# Altium project lpedt_project_board_cubit.PrjPcb (part 2 of 4)

## Sheet efr32_radio_interface.SchDoc
size Letter; SheetNumber: 4; SheetTotal: 8
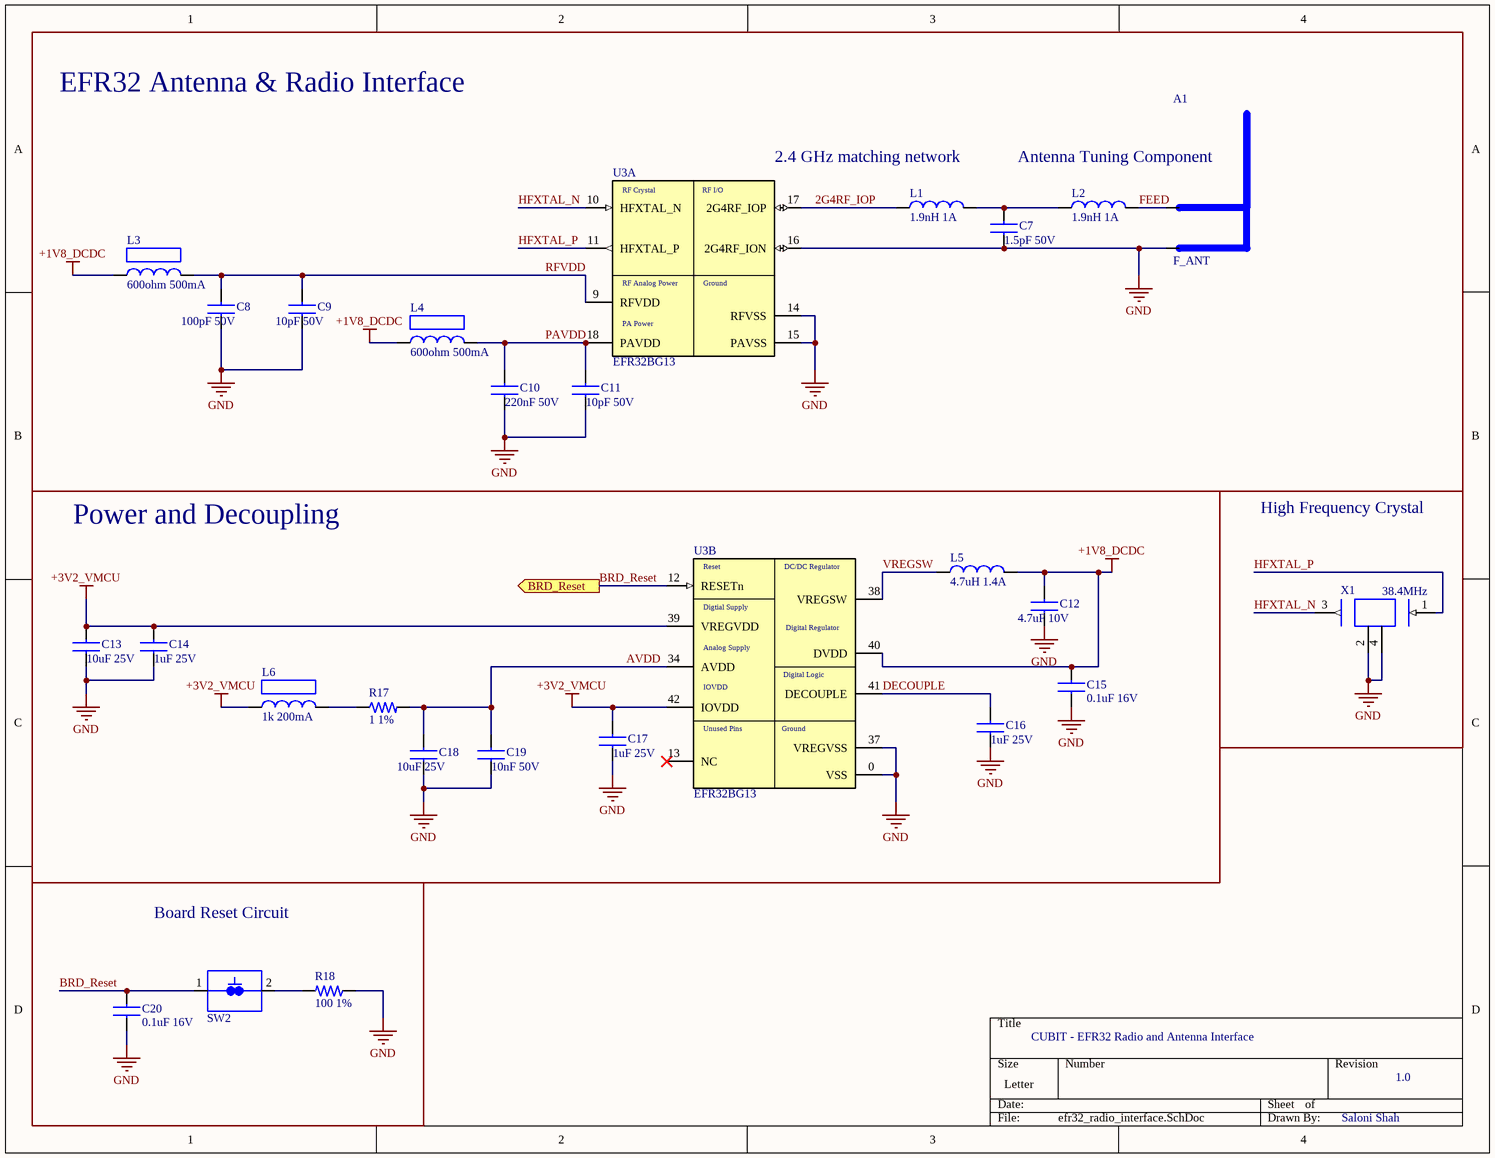
[diagram p2: efr32_radio_interface.SchDoc]

### Parts
A1  F_ANT  [F_ANTENNA_FOOTPRINT]  (net tie, no BOM)
C7  1.5pF 50V  [CAP_0402_1mm]
C8  100pF 50V  [CAP_0805_02X125]
C9  10pF 50V  [CAP_0805_02X125]
C10  220nF 50V  [CAP_0805_02X125]
C11  10pF 50V  [CAP_0805_02X125]
C12  4.7uF 10V  [CAP_0603_1MM]
C13  10uF 25V  [CAP_0805_02X125]
C14  1uF 25V  [CAP_0805_02X125]
C15  0.1uF 16V  [CAP_0603_1MM]
C16  1uF 25V  [CAP_0805_02X125]
C17  1uF 25V  [CAP_0805_02X125]
C18  10uF 25V  [CAP_0805_02X125]
C19  10nF 50V  [CAP_0805_02X125]
C20  0.1uF 16V  [CAP_0603_1MM]
L1  1.9nH 1A  [CAP_0402_1mm]
L2  1.9nH 1A  [CAP_0402_1mm]
L3  600ohm 500mA  [IND_FERRITE_0603_1.6x0.4]
L4  600ohm 500mA  [IND_FERRITE_0603_1.6x0.4]
L5  4.7uH 1.4A  [INDP2523X23N_4u7]
L6  1k 200mA  [CAP_0603_1MM]
R17  1 1%  [CAP_0603_1MM]
R18  100 1%  [2_Chip_0603_RMCF]
SW2  Switch  [Reset Sw]  (value not drawn)
U3  EFR32BG13  [48-QFN_7x7]  (parts A,B of 3)
X1  38.4MHz  [OSC_38.4MHz]

### Blocks framed on the sheet
EFR32 Antenna & Radio Interface: A1 C7-C11 L1-L4 U3
Power and Decoupling: C12-C19 L5 L6 R17 U3
High Frequency Crystal: X1
Board Reset Circuit: C20 R18 SW2

### Ports
BRD_Reset (out)

### Nets
+1V8_DCDC: C12.1 C15.1 L3.1 L4.1 L5.2 U3.40(DVDD)
+3V2_VMCU: C13.1 C14.1 C17.1 L6.1 U3.39(VREGVDD) U3.42(IOVDD)
GND: A1.GND C7.2 C8.2 C9.2 C10.2 C11.2 C12.2 C13.2 C14.2 C15.2 C16.2 C17.2 C18.2 C19.2 C20.2 R18.1 U3.0(VSS) U3.14(RFVSS) U3.15(PAVSS) U3.16(2G4RF_ION) U3.37(VREGVSS) X1.2 X1.4
2G4RF_IOP: L1.1 U3.17(2G4RF_IOP)
AVDD: C18.1 C19.1 R17.2 U3.34(AVDD)
BRD_Reset: C20.1 SW2.1 U3.12(RESETn) ; port BRD_Reset
DECOUPLE: C16.1 U3.41(DECOUPLE)
FEED: A1.FEED L2.2
HFXTAL_N: U3.10(HFXTAL_N) X1.3
HFXTAL_P: U3.11(HFXTAL_P) X1.1
PAVDD: C10.1 C11.1 L4.2 U3.18(PAVDD)
RFVDD: C8.1 C9.1 L3.2 U3.9(RFVDD)
VREGSW: L5.1 U3.38(VREGSW)
NetC7_1: C7.1 L1.2 L2.1
NetL6_2: L6.2 R17.1
NetR18_2: R18.2 SW2.2

Not connected (* = marked no-connect by the designer): U3 13(NC)*

### Notes on the sheet
- 2.4 GHz matching network
- Antenna Tuning Component
- CUBIT - EFR32 Radio and Antenna Interface
- 1.0
- Saloni Shah
- (in symbol EFR32BG13P732F512GM48-D, part A) RF Crystal; RF I/O; RF Analog Power; Ground; PA Power
- (in symbol EFR32BG13P732F512GM48-D, part B) Reset; DC/DC Regulator; Digtial Supply; Digital Regulator; Analog Supply; Digital Logic; Unused Pins; Ground

### Library data of the parts
C7 = GCM1555C1H1R5JA16D: Cap Ceramic 1.5pF 50V C0G 5% Pad SMD 0402 125C Automotive T/R; Manufacturer: Murata; Supplier 1: Digi-Key; Manufacturer Part Number: GCM1555C1H1R5JA16D; RoHS: Yes; Category: Ceramic Capacitors; Stock 1: 77943; Pricing 1: 1=0.10000, 10=0.04700, 50=0.02580, 100=0.02100, 500=0.01502, 1000=0.01180, 2500=0.01072, 5000=0.00987 (USD); Mount: Surface Mount; Case/Package: 0402; Case Code (Imperial): 0402; Case Code (Metric): 1005; Min Operating Temperature: -55°C; Max Operating Temperature: 125°C; Packaging: Cut Tape; Capacitance: 1.5pF; Tolerance: 5%; Voltage Rating: 50V; Ratings: AEC-Q200; ComponentLink1URL: http://search.murata.co.jp/Ceramy/image/img/A01X/G101/ENG/GCM1555C1H1R5JA16-01.pdf?src-supplier=Digi-Key; ComponentLink1Description: http://search.murata.co.jp/Ceramy/image/img/A01X/G101/ENG/GCM1555C1H1R5JA16-01.pdf?src-supplier=Digi-Key
C8 = CC0805KRX7R9BB101: Cap 0.1nF ±10% 50V X7R 0805; Manufacturer: Yageo; Supplier 1: Digi-Key; Manufacturer Part Number: CC0805KRX7R9BB101; RoHS: Yes; Category: Ceramic Capacitors; Stock 1: 2346; Pricing 1: 1=0.11000, 10=0.08200, 50=0.04620, 100=0.03830, 500=0.02688, 1000=0.02225 (USD); Mount: Surface Mount; Case/Package: 0805; Case Code (Imperial): 0805; Case Code (Metric): 2012; Weight: 0.000194oz; Min Operating Temperature: -55°C; Max Operating Temperature: 125°C; Capacitance: 100pF; Tolerance: 10%; Packaging: Tape and Reel; Voltage Rating (DC): 50V; Voltage Rating: 50V; Dielectric: X7R; Termination: SMD/SMT; Resistor Type: Ceramic; Series: CC; Construction: Flat; Length: 2mm; Width: 0.049inch; Thickness: 0.028inch; Depth: 1.25mm; Radiation Hardening: No; Lead Free: Lead Free; Halogen Free: Halogen Free; RoHS Compliant: Yes; ComponentLink1URL: https://datasheet.ciiva.com/11465/upy-gphc-x7r-6-3v-to-50v-8-11465306.pdf?src-supplier=Avnet; ComponentLink1Description: https://datasheet.ciiva.com/11465/upy-gphc-x7r-6-3v-to-50v-8-11465306.pdf?src-supplier=Avnet; ComponentLink2URL: https://datasheet.ciiva.com/17436/upy-gphc-x7r-6-3v-to-50v-8-17436651.pdf?src-supplier=Avnet+Europe; ComponentLink2Description: https://datasheet.ciiva.com/17436/upy-gphc-x7r-6-3v-to-50v-8-17436651.pdf?src-supplier=Avnet+Europe
C9 C11 = C0805C100K5RACTU: Cap Ceramic 10pF 50V X7R 10% SMD 0805 125°C Paper T/R; Manufacturer: KEMET; Supplier 1: Digi-Key; Manufacturer Part Number: C0805C100K5RACTU; RoHS: Yes; Category: Ceramic Capacitors; Stock 1: 16008; Pricing 1: 1=0.29000, 10=0.19600, 50=0.11780, 100=0.09950, 500=0.06806, 1000=0.06021 (USD); Case/Package: 0805; Dielectric Material: Ceramic; Voltage Rating (DC): 50V; Dielectric: X7R; Tolerance: 10%; Capacitance: 10pF; RoHS Compliant: Yes; ComponentLink1URL: http://www.farnell.com/datasheets/2747373.pdf?src-supplier=Farnell; ComponentLink1Description: http://www.farnell.com/datasheets/2747373.pdf?src-supplier=Farnell; ComponentLink2URL: http://www.farnell.com/datasheets/2747373.pdf?src-supplier=Newark; ComponentLink2Description: http://www.farnell.com/datasheets/2747373.pdf?src-supplier=Newark
C10 = CC0805KKX7R9BB224: Cap 220nF ±10% 50V X7R 0805; Manufacturer: Yageo; Supplier 1: Digi-Key; Manufacturer Part Number: CC0805KKX7R9BB224; RoHS: Yes; Category: Ceramic Capacitors; Stock 1: 57217; Pricing 1: 1=0.18000, 10=0.12600, 50=0.07140, 100=0.05920, 500=0.04154, 1000=0.03439 (USD); Mount: Surface Mount; Case/Package: 0805; Case Code (Imperial): 0805; Case Code (Metric): 2012; Weight: 0.000194oz; Min Operating Temperature: -55°C; Max Operating Temperature: 125°C; Capacitance: 220nF; Tolerance: 10%; Packaging: Tape and Reel; Voltage Rating: 50V; Voltage Rating (DC): 50V; Dielectric: X7R; Termination: SMD/SMT; Resistor Type: Ceramic; Series: CC; Construction: Flat; Length: 2mm; Width: 0.049inch; Height: 1.25mm; Thickness: 0.057inch; Depth: 1.25mm; Radiation Hardening: No; Lead Free: Lead Free; Halogen Free: Halogen Free; RoHS Compliant: Yes; ComponentLink1URL: https://datasheet.ciiva.com/26862/getdatasheetpartid-403679-26862968.pdf?src-supplier=Verical; ComponentLink1Description: https://datasheet.ciiva.com/26862/getdatasheetpartid-403679-26862968.pdf?src-supplier=Verical; ComponentLink2URL: https://datasheet.ciiva.com/15375/yageo-486313-494411-15375807.pdf?src-supplier=Mouser; ComponentLink2Description: https://datasheet.ciiva.com/15375/yageo-486313-494411-15375807.pdf?src-supplier=Mouser
C12 = CL10A475KP8NNNC: Cap CL10 Series 4.7 uF 10 V ±10 % Tolerance X5R SMT Multilayer Ceramic Capacitor; Manufacturer: Samsung; Tolerance: 10%; Supplier 1: Digi-Key; Manufacturer Part Number: CL10A475KP8NNNC; RoHS: Yes; Category: Ceramic Capacitors; Stock 1: 5517923; Pricing 1: 1=0.10000, 10=0.04700, 50=0.02580, 100=0.02110, 500=0.01506, 1000=0.01183 (USD); Mount: Surface Mount; Case/Package: 0603; Case Code (Metric): 1608; Case Code (Imperial): 0603; Contact Plating: Tin; Min Operating Temperature: -55°C; Max Operating Temperature: 85°C; Capacitance: 4.7uF; Dielectric: X5R; Package Quantity: 1; Packaging: Tape and Reel; Voltage Rating: 10V; Series: CL; Construction: Flat; Length: 1.6mm; Width: 0.031inch; Height: 0.8mm; Thickness: 0.035inch; Depth: 0.8mm; Radiation Hardening: No; RoHS Compliant: Yes; ComponentLink1URL: https://datasheet.ciiva.com/25797/cl10a475kp8nnnc-25797520.pdf?src-supplier=Digi-Key; ComponentLink1Description: https://datasheet.ciiva.com/25797/cl10a475kp8nnnc-25797520.pdf?src-supplier=Digi-Key; ComponentLink2URL: https://datasheet.ciiva.com/26838/getdatasheetpartid-358676-26838384.pdf?src-supplier=Verical; ComponentLink2Description: https://datasheet.ciiva.com/26838/getdatasheetpartid-358676-26838384.pdf?src-supplier=Verical; ComponentLink3URL: https://datasheet.ciiva.com/16318/cl05b104kq5nnnc-16318245.pdf?src-supplier=Future+Electronics; ComponentLink3Description: https://datasheet.ciiva.com/16318/cl05b104kq5nnnc-16318245.pdf?src-supplier=Future+Electronics
C13 C18 = GRM21BR61E106KA73K: Cap 0805 25 V 10 uF ±20% Tolerance X5R Monolithic Ceramic Chip Capacitor; Manufacturer: Murata; Tolerance: 10%; Supplier 1: Digi-Key; Manufacturer Part Number: GRM21BR61E106KA73K; RoHS: Yes; Category: Ceramic Capacitors; Stock 1: 1875; Pricing 1: 1=0.23000, 10=0.15700, 50=0.09400, 100=0.07940, 500=0.05434, 1000=0.04807, 2500=0.04598, 5000=0.04180 (USD); Mount: Surface Mount; Case/Package: 0805; Weight: 0.000335oz; Min Operating Temperature: -55°C; Max Operating Temperature: 85°C; Packaging: Tape and Reel; Capacitance: 10uF; Voltage Rating: 25V; Package Quantity: 10000; Dielectric: X5R; Voltage Rating (DC): 25V; Length: 0.079inch; Width: 0.049inch; Thickness: 0.055inch; RoHS Compliant: Yes; ComponentLink1URL: http://www.mouser.com/ds/2/281/c02e-2905.pdf?src-supplier=Mouser; ComponentLink1Description: http://www.mouser.com/ds/2/281/c02e-2905.pdf?src-supplier=Mouser; ComponentLink2URL: http://search.murata.co.jp/Ceramy/image/img/A01X/G101/ENG/GRM21BR61E106KA73-01.pdf?src-supplier=Digi-Key; ComponentLink2Description: http://search.murata.co.jp/Ceramy/image/img/A01X/G101/ENG/GRM21BR61E106KA73-01.pdf?src-supplier=Digi-Key; ComponentLink3URL: https://search.murata.co.jp/Ceramy/image/img/A01X/G101/ENG/GRM21BR61E106KA73-01.pdf?src-supplier=Digi-Key; ComponentLink3Description: https://search.murata.co.jp/Ceramy/image/img/A01X/G101/ENG/GRM21BR61E106KA73-01.pdf?src-supplier=Digi-Key
C14 C16 C17 = GRM216R61E105KA12D: Cap 1 µF ±10% 25V Ceramic Capacitor X5R 0805 (2012 Metric); Manufacturer: Murata; Supplier 1: Digi-Key; Manufacturer Part Number: GRM216R61E105KA12D; RoHS: Yes; Category: Ceramic Capacitors; Stock 1: 738438; Pricing 1: 4000=0.09051, 8000=0.08518, 12000=0.08252, 28000=0.07986, 100000=0.06921 (USD); Mount: Surface Mount; Case/Package: 0805; Number of Pins: 2; Case Code (Imperial): 0805; Case Code (Metric): 2012; Material: Ceramic; Min Operating Temperature: -55°C; Max Operating Temperature: 85°C; Package Quantity: 1; Series: GRM; Packaging: Tape and Reel; Capacitance: 1uF; Voltage Rating: 25V; Voltage Rating (DC): 25V; Tolerance: 10%; Dielectric: X5R; Termination: SMD/SMT; Voltage: 25V; Construction: Flat; Length: 2mm; Width: 1.25mm; Height: 0.6mm; Thickness: 0.028inch; Depth: 1.25mm; Radiation Hardening: No; Lead Free: Lead Free; REACH SVHC: No SVHC; RoHS Compliant: Yes; ComponentLink1URL: https://datasheet.ciiva.com/11787/0900766b80ef921d-11787891.pdf?src-supplier=RSComponents; ComponentLink1Description: https://datasheet.ciiva.com/11787/0900766b80ef921d-11787891.pdf?src-supplier=RSComponents; ComponentLink2URL: https://datasheet.ciiva.com/5424/product-5424880.pdf?src-supplier=Mouser; ComponentLink2Description: https://datasheet.ciiva.com/5424/product-5424880.pdf?src-supplier=Mouser; ComponentLink3URL: https://datasheet.ciiva.com/3777/337grm216r61e105ka1223-3777289.pdf?src-supplier=Arrow+Electronics; ComponentLink3Description: https://datasheet.ciiva.com/3777/337grm216r61e105ka1223-3777289.pdf?src-supplier=Arrow+Electronics; ComponentLink4URL: https://datasheet.ciiva.com/7719/c02e-7719049.pdf?src-supplier=Element14; ComponentLink4Description: https://datasheet.ciiva.com/7719/c02e-7719049.pdf?src-supplier=Element14; ComponentLink5URL: https://datasheet.ciiva.com/22706/1889704-22706791.pdf?src-supplier=Element14; ComponentLink5Description: https://datasheet.ciiva.com/22706/1889704-22706791.pdf?src-supplier=Element14; ComponentLink6URL: https://datasheet.ciiva.com/138/partnumbering-e-01-138518.pdf?src-supplier=Digi-Key; ComponentLink6Description: https://datasheet.ciiva.com/138/partnumbering-e-01-138518.pdf?src-supplier=Digi-Key; ComponentLink7URL: https://datasheet.ciiva.com/138/partnumbering-e-01-138517.pdf?src-supplier=Digi-Key; ComponentLink7Description: https://datasheet.ciiva.com/138/partnumbering-e-01-138517.pdf?src-supplier=Digi-Key; ComponentLink8URL: https://datasheet.ciiva.com/138/partnumbering-e-01-138519.pdf?src-supplier=Digi-Key; ComponentLink8Description: https://datasheet.ciiva.com/138/partnumbering-e-01-138519.pdf?src-supplier=Digi-Key; ComponentLink9URL: https://datasheet.ciiva.com/2989/product-2989638.pdf?src-supplier=Avnet; ComponentLink9Description: https://datasheet.ciiva.com/2989/product-2989638.pdf?src-supplier=Avnet
C15 C20 = C0805C104K4RACAUTO: Cap Ceramic 0.1uF 16V X7R 10% SMD 0603 125°C Paper T/R; Manufacturer: KEMET; Capacitance: 100nF; Supplier 1: Digi-Key; Manufacturer Part Number: C0805C104K4RACAUTO; RoHS: Yes; Category: Ceramic Capacitors; Stock 1: 15900; Pricing 1: 1=0.24000, 10=0.16200, 50=0.09700, 100=0.08190, 500=0.05606, 1000=0.04959 (USD); Case/Package: 0805; Min Operating Temperature: -55°C; Max Operating Temperature: 125°C; Tolerance: 10%; Packaging: Tape and Reel; Dielectric: X7R; Length: 2mm; Depth: 1.25mm; RoHS Compliant: Yes; ComponentLink1URL: http://components.arrow.com/part/dataview/0323_00325188?src-supplier=Arrow+Europe; ComponentLink1Description: http://components.arrow.com/part/dataview/0323_00325188?src-supplier=Arrow+Europe
C19 = CL21B103KBCNNNC: Cap 10nF ±10% 50V X7R 0805; Manufacturer: Samsung; Supplier 1: Digi-Key; Manufacturer Part Number: CL21B103KBCNNNC; RoHS: Yes; Category: Ceramic Capacitors; Stock 1: 358475; Pricing 1: 1=0.10000, 10=0.05000, 50=0.02700, 100=0.02210, 500=0.01578, 1000=0.01240 (USD); Mount: Surface Mount; Case/Package: 0805; Case Code (Metric): 2012; Case Code (Imperial): 0805; Contact Plating: Tin; Min Operating Temperature: -55°C; Max Operating Temperature: 125°C; Packaging: Tape and Reel; Series: CL; Voltage Rating: 50V; Capacitance: 10nF; Tolerance: 10%; Dielectric: X7R; Voltage Rating (DC): 50V; Construction: Flat; Length: 2mm; Width: 0.049inch; Height: 0.85mm; Thickness: 0.037inch; Depth: 1.25mm; Radiation Hardening: No; RoHS Compliant: Yes; Lead Free: Lead Free; ComponentLink1URL: https://datasheet.ciiva.com/26920/getdatasheetpartid-640087-26920198.pdf?src-supplier=Verical; ComponentLink1Description: https://datasheet.ciiva.com/26920/getdatasheetpartid-640087-26920198.pdf?src-supplier=Verical; ComponentLink2URL: https://datasheet.ciiva.com/26787/cl21b103kbcnnnc-26787008.pdf?src-supplier=IIIC; ComponentLink2Description: https://datasheet.ciiva.com/26787/cl21b103kbcnnnc-26787008.pdf?src-supplier=IIIC
L1 L2 = LQG15WZ1N9S02D: Inductor Chip 1.9nH 0.3nH Tolerance 2-Pin 0402 Paper T/R; Manufacturer: Murata; Supplier 1: Digi-Key; Manufacturer Part Number: LQG15WZ1N9S02D; RoHS: Yes; Category: Fixed Inductors; Stock 1: 7252; Pricing 1: 1=0.14000, 10=0.12900, 25=0.11440, 50=0.09720, 100=0.08580, 250=0.07864, 500=0.07150, 1000=0.06006, 2500=0.05148 (USD); RoHS Compliant: Yes
L3 L4 = BLM18AG601SN1D: Ferrite Beads 0603 600Ω ±25% DCR=0.38Ω 500mA; Manufacturer: Murata; Material: Steel,Ferrite; Frequency: 100MHz; Impedance: 600R; Number of Lines: 1; DC Resistance (DCR): 380mR; Shielding: Unshielded; Supplier 1: Digi-Key; Manufacturer Part Number: BLM18AG601SN1D; RoHS: Yes; Category: Inductors; Pricing 1: 1=0.10000, 10=0.07900, 25=0.07200, 50=0.06480, 100=0.04760, 250=0.03460, 500=0.03170, 1000=0.02738 (USD); Case/Package: 0603; Number of Pins: 2; Core Material: Ferrite; Case Code (Metric): 1608; Case Code (Imperial): 0603; Weight: 7.1E-05oz; Min Operating Temperature: -55°C; Max Operating Temperature: 125°C; Package Quantity: 1; Packaging: Tape and Reel; Tolerance: 25%; Max Current Rating: 500mA; Current Rating: 500mA; Termination: SMD/SMT; Max DC Current: 500mA; Test Frequency: 100MHz; DC Current: 500mA; Number of Circuits: 1; Length: 1.6mm; Width: 0.8mm; Height: 0.8mm; Depth: 0.8mm; Radiation Hardening: No; RoHS Compliant: Yes; Lead Free: Lead Free; REACH SVHC: No SVHC; Military Standard: Not; ComponentLink1URL: https://datasheet.ciiva.com/19460/1844766-19460213.pdf?src-supplier=Jameco; ComponentLink1Description: https://datasheet.ciiva.com/19460/1844766-19460213.pdf?src-supplier=Jameco; ComponentLink2URL: https://datasheet.ciiva.com/41449/001172228-da-01-en-drossel-0603-600r-1-6x0-8mm-4000st-41449517.pdf?src-supplier=Conrad; ComponentLink2Description: https://datasheet.ciiva.com/41449/001172228-da-01-en-drossel-0603-600r-1-6x0-8mm-4000st-41449517.pdf?src-supplier=Conrad; ComponentLink3URL: https://datasheet.ciiva.com/29347/442309-da-01-en-chip-drossel-0603-600r-500ma-1-6x0-8mm-29347900.pdf?src-supplier=Conrad; ComponentLink3Description: https://datasheet.ciiva.com/29347/442309-da-01-en-chip-drossel-0603-600r-500ma-1-6x0-8mm-29347900.pdf?src-supplier=Conrad; ComponentLink4URL: https://datasheet.ciiva.com/1466/1756147-1466934.pdf?src-supplier=Element14; ComponentLink4Description: https://datasheet.ciiva.com/1466/1756147-1466934.pdf?src-supplier=Element14; ComponentLink5URL: https://datasheet.ciiva.com/1466/1756147-1466933.pdf?src-supplier=Element14; ComponentLink5Description: https://datasheet.ciiva.com/1466/1756147-1466933.pdf?src-supplier=Element14; ComponentLink6URL: https://datasheet.ciiva.com/1012/l0110s0100blm18a-1012018.pdf?src-supplier=Digi-Key; ComponentLink6Description: https://datasheet.ciiva.com/1012/l0110s0100blm18a-1012018.pdf?src-supplier=Digi-Key; ComponentLink7URL: https://datasheet.ciiva.com/1012/l0110s0100blm18a-1012017.pdf?src-supplier=Digi-Key; ComponentLink7Description: https://datasheet.ciiva.com/1012/l0110s0100blm18a-1012017.pdf?src-supplier=Digi-Key; ComponentLink8URL: https://datasheet.ciiva.com/1012/l0110s0100blm18a-1012019.pdf?src-supplier=Digi-Key; ComponentLink8Description: https://datasheet.ciiva.com/1012/l0110s0100blm18a-1012019.pdf?src-supplier=Digi-Key; ComponentLink9URL: https://datasheet.ciiva.com/16210/l0110s0100blm18a-16210006.pdf?src-supplier=Future+Electronics; ComponentLink9Description: https://datasheet.ciiva.com/16210/l0110s0100blm18a-16210006.pdf?src-supplier=Future+Electronics; ComponentLink10URL: https://datasheet.ciiva.com/3081/l0110s0100blm18a-3081613.pdf?src-supplier=Avnet; ComponentLink10Description: https://datasheet.ciiva.com/3081/l0110s0100blm18a-3081613.pdf?src-supplier=Avnet
L5 = DFE252012P-4R7M=P2: 4.7uH, 20%, 1 Element, Metal Alloy-Core, SMD, 1008; Manufacturer: Murata; DC Resistance (DCR): 200mR; Inductor Type: GENERAL PURPOSE INDUCTOR; Number of Functions: 1; Shape/Size Description: RECTANGULAR PACKAGE; Shielding: Shielded; Test Frequency: 1MHz; Supplier 1: Digikey; Manufacturer Part Number: DFE252012P-4R7M=P2; RoHS: Yes; Category: Fixed Inductors; Stock 1: 44321; Pricing 1: 1=0.28, 10=0.228, 25=0.21, 50=0.1926, 100=0.1698, 250=0.1646, 500=0.14708, 1000=0.11907 (USD); Number of Pins: 2; Core Material: Metal; Min Operating Temperature: -40°C; Max Operating Temperature: 125°C; Tolerance: 20%; Inductance-Nom (L): 4.7uH; Rated Current-Max: 1.4A; Surface Mount: Yes; Terminal Placement: Dual Ended; Termination: Wraparound; Reach SVHC Compliant: Yes; RoHS Compliant: Yes; ComponentLink1URL: https://psearch.en.murata.com:443/inductor/product/DFE252012P-4R7M_.pdf?src-supplier=IHS+Markit; ComponentLink1Description: https://psearch.en.murata.com:443/inductor/product/DFE252012P-4R7M_.pdf?src-supplier=IHS+Markit; ComponentLink2URL: http://www.farnell.com/datasheets/2550138.pdf?src-supplier=Farnell; ComponentLink2Description: http://www.farnell.com/datasheets/2550138.pdf?src-supplier=Farnell; ComponentLink3URL: http://www.murata.com/~/media/webrenewal/products/inductor/chip/tokoproducts/wirewoundmetalalloychiptype/m_dfe252012p.ashx?src-supplier=Digikey; ComponentLink3Description: http://www.murata.com/~/media/webrenewal/products/inductor/chip/tokoproducts/wirewoundmetalalloychiptype/m_dfe252012p.ashx?src-supplier=Digikey; ComponentLink4URL: https://www.murata.com/~/media/webrenewal/products/inductor/chip/tokoproducts/wirewoundmetalalloychiptype/m_dfe252012p.ashx?src-supplier=Digikey; ComponentLink4Description: https://www.murata.com/~/media/webrenewal/products/inductor/chip/tokoproducts/wirewoundmetalalloychiptype/m_dfe252012p.ashx?src-supplier=Digikey; ComponentLink5URL: http://www.toko.co.jp/products/pdf/inductors/dfe252012p.pdf?src-supplier=Avnet; ComponentLink5Description: http://www.toko.co.jp/products/pdf/inductors/dfe252012p.pdf?src-supplier=Avnet; ComponentLink6URL: http://www.farnell.com/datasheets/2550138.pdf?src-supplier=Newark; ComponentLink6Description: http://www.farnell.com/datasheets/2550138.pdf?src-supplier=Newark
L6 = 74279266: Ferrite Beads WE-CBF 0603 SMD Bead 100MHz 1000Ohm 200mA; Manufacturer: Wurth Electronics; Tolerance: 25%; Impedance: 1kR; DC Resistance (DCR): 600mR; Inductance: 1.8nH; Shielding: Unshielded; Number of Lines: 1; Supplier 1: Digi-Key; Manufacturer Part Number: 74279266; RoHS: Yes; Category: Ferrite Beads and Chips; Pricing 1: 1=0.18000, 50=0.17400, 100=0.16000, 500=0.15300, 1000=0.14600, 2000=0.13900 (USD); Case/Package: SMD/SMT; Case Code (Metric): 1608; Case Code (Imperial): 0603; Core Material: Ferrite; Min Operating Temperature: -55°C; Max Operating Temperature: 125°C; Packaging: Tape and Reel; Series: WE-CBF; Current Rating: 200mA; Max DC Current: 200mA; Termination: SMD/SMT; Test Frequency: 100MHz; Max Current Rating: 200mA; Length: 1.6mm; Width: 0.8mm; Height: 0.8mm; Depth: 0.8mm; REACH SVHC: Unknown; Lead Free: Lead Free; RoHS Compliant: Yes; ComponentLink1URL: https://datasheet.ciiva.com/23763/74279266-23763009.pdf?src-supplier=Newark; ComponentLink1Description: https://datasheet.ciiva.com/23763/74279266-23763009.pdf?src-supplier=Newark; ComponentLink2URL: https://datasheet.ciiva.com/11799/0900766b801ef1d0-11799352.pdf?src-supplier=RSComponents; ComponentLink2Description: https://datasheet.ciiva.com/11799/0900766b801ef1d0-11799352.pdf?src-supplier=RSComponents; ComponentLink3URL: https://datasheet.ciiva.com/12395/74279266-221135-12395453.pdf?src-supplier=Mouser; ComponentLink3Description: https://datasheet.ciiva.com/12395/74279266-221135-12395453.pdf?src-supplier=Mouser; ComponentLink4URL: https://datasheet.ciiva.com/14971/74279266-14971192.pdf?src-supplier=Digi-Key; ComponentLink4Description: https://datasheet.ciiva.com/14971/74279266-14971192.pdf?src-supplier=Digi-Key; ComponentLink5URL: https://datasheet.ciiva.com/14634/0900766b801ef1d0-14634816.pdf?src-supplier=Allied+Electronics; ComponentLink5Description: https://datasheet.ciiva.com/14634/0900766b801ef1d0-14634816.pdf?src-supplier=Allied+Electronics; ComponentLink6URL: https://datasheet.ciiva.com/1466/1705901-1466509.pdf?src-supplier=Element14; ComponentLink6Description: https://datasheet.ciiva.com/1466/1705901-1466509.pdf?src-supplier=Element14; ComponentLink7URL: https://datasheet.ciiva.com/22711/1705901-22711422.pdf?src-supplier=Element14; ComponentLink7Description: https://datasheet.ciiva.com/22711/1705901-22711422.pdf?src-supplier=Element14; ComponentLink8URL: https://datasheet.ciiva.com/48698/001087059-da-01-ml-we-cbf-smd-ferrit-74279266-de-en-48698427.pdf?src-supplier=Conrad; ComponentLink8Description: https://datasheet.ciiva.com/48698/001087059-da-01-ml-we-cbf-smd-ferrit-74279266-de-en-48698427.pdf?src-supplier=Conrad
R17 = RC0603FR-101RL: Res 1 Ohm 1% 1/10W ±200ppm/°C Molded SMD SMD Paper T/R; Manufacturer: Yageo; Resistance: 1R; Power Rating: 100mW; Voltage Rating: 50V; Supplier 1: Digi-Key; Manufacturer Part Number: RC0603FR-101RL; Category: Chip SMD Resistors; Stock 1: 19075; Pricing 1: 1=0.10000, 10=0.04800, 100=0.01940, 1000=0.00872, 2500=0.00756, 5000=0.00625 (USD); Case/Package: 0603; Case Code (Imperial): 0603; Case Code (Metric): 1608; Contact Plating: Tin; Min Operating Temperature: -55°C; Max Operating Temperature: 155°C; Tolerance: 1%; Packaging: Tape and Reel; Resistor Type: Thick Film; Termination: SMD/SMT; Temperature Coefficient: 200ppm/°C; Series: RC; Construction: Rectangular; Length: 1.6mm; Width: 0.8mm; Height: 0.45mm; Depth: 0.8mm; Radiation Hardening: No; Military Standard: Not; RoHS Compliant: Yes; ComponentLink1URL: http://www.mouser.com/ds/2/447/RC0603-272842.pdf?src-supplier=Mouser; ComponentLink1Description: http://www.mouser.com/ds/2/447/RC0603-272842.pdf?src-supplier=Mouser; ComponentLink2URL: http://components.arrow.com/part/dataview/0323_03914755?src-supplier=Arrow+Europe; ComponentLink2Description: http://components.arrow.com/part/dataview/0323_03914755?src-supplier=Arrow+Europe; ComponentLink3URL: http://www.yageo.com/documents/recent/PYu-RC_Group_51_RoHS_L_2.pdf?src-supplier=Avnet; ComponentLink3Description: http://www.yageo.com/documents/recent/PYu-RC_Group_51_RoHS_L_2.pdf?src-supplier=Avnet; ComponentLink4URL: http://www.yageo.com/documents/recent/PYu-RC0603_51_RoHS_L_5.pdf?src-supplier=Avnet+Europe; ComponentLink4Description: http://www.yageo.com/documents/recent/PYu-RC0603_51_RoHS_L_5.pdf?src-supplier=Avnet+Europe; ComponentLink5URL: https://datasheet.octopart.com/RC0603FR-101RL-Yageo-datasheet-8328172.pdf?src-supplier=_legacy+Avnet; ComponentLink5Description: https://datasheet.octopart.com/RC0603FR-101RL-Yageo-datasheet-8328172.pdf?src-supplier=_legacy+Avnet; ComponentLink6URL: https://datasheet.octopart.com/RC0603FR-101RL-Yageo-datasheet-73766026.pdf; ComponentLink6Description: https://datasheet.octopart.com/RC0603FR-101RL-Yageo-datasheet-73766026.pdf
R18 = RMCF0603FT100R: Res 100 Ohm 1% 1/10W ±100ppm/°C Molded SMD SMD Paper T/R; Manufacturer: Stackpole Electronics; Resistance: 100R; Power Rating: 100mW; Supplier 1: Digi-Key; Manufacturer Part Number: RMCF0603FT100R; RoHS: Yes; Category: Chip SMD Resistors; Pricing 1: 1=0.10000, 10=0.01700, 100=0.00680, 1000=0.00305, 2500=0.00264 (USD); Mount: Surface Mount; Case/Package: 0603; Case Code (Metric): 1608; Case Code (Imperial): 0603; Contact Plating: Tin,Matte; Size Code: 0603; Min Operating Temperature: -55°C; Max Operating Temperature: 155°C; Tolerance: 1%; Packaging: Tape and Reel; Resistor Type: Thick Film; Number of Terminations: 2; Max Power Dissipation: 100mW; Temperature Coefficient: 100ppm/°C; Features: Automotive AEC-Q200; Series: RMCF; Construction: Rectangular; Length: 1.55mm; Width: 0.031inch; Height: 0.022inch; Depth: 0.8mm; Radiation Hardening: No; Military Standard: Not; Lead Free: Lead Free; RoHS Compliant: Yes; ComponentLink1URL: https://datasheet.ciiva.com/15215/getdatasheetpartid-360413-15215981.pdf?src-supplier=Verical; ComponentLink1Description: https://datasheet.ciiva.com/15215/getdatasheetpartid-360413-15215981.pdf?src-supplier=Verical
SW2 = PTS636SL43SMTRLFS: Keypad Switch, 1 Switches, SPST, Momentary-tactile, 0.05A, 12VDC, 1.77N, Solder Terminal, Surface Mount-straight; Manufacturer: ITT C&K; Supplier 1: Digikey; Manufacturer Part Number: PTS636SL43SMTRLFS; RoHS: No; Category: Tactile Switches; Stock 1: 11938; Pricing 1: 1=0.19, 10=0.187, 25=0.1776, 100=0.1616, 250=0.15192, 500=0.13898 (USD); RoHS Compliant: Yes
U3 = EFR32BG13P732F512GM48-D: Blue Gecko QFN48 2.4 G 19 dB BLE/Proprietary 512 kB 64 kB(RAM) 31GPIO; Manufacturer: Silicon Labs; Supplier 1: Digi-Key; Manufacturer Part Number: EFR32BG13P732F512GM48-D; RoHS: Yes; Category: RF Receivers, Transceivers; Pricing 1: 1=8.42000, 10=7.72000, 25=7.01800, 80=6.31625, 230=5.78987, 440=5.26350, 945=4.78499 (USD); ComponentLink1URL: http://www.farnell.com/datasheets/2813683.pdf?src-supplier=Farnell; ComponentLink1Description: http://www.farnell.com/datasheets/2813683.pdf?src-supplier=Farnell
X1 = RH100-38.400-10-F-1010-TR: Crystal 38.4000MHZ 10PF SMD; Manufacturer: Raltron Electronics; Supplier 1: Digi-Key; Manufacturer Part Number: RH100-38.400-10-F-1010-TR; RoHS: Yes; Stock 1: 6000; Pricing 1: 1=0.39000, 10=0.32400, 50=0.29180, 100=0.25940, 500=0.24640, 1000=0.20750 (USD)